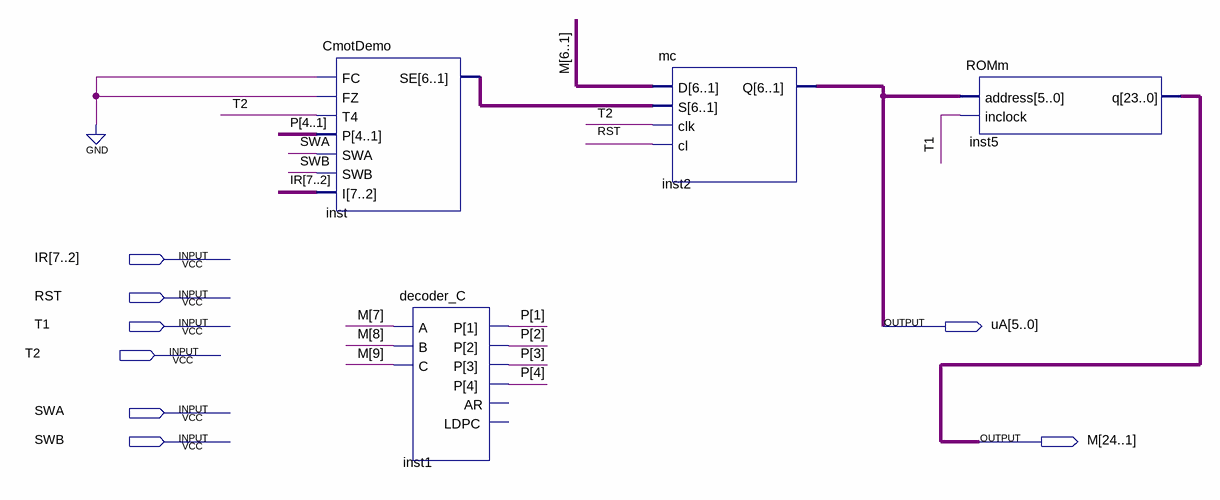
[diagram p0: schematic sheet]
// Quartus schematic UPC.bdf as structural Verilog: 4 symbols, 8 pins
module UPC (
  input  [7:2] IR,
  input  RST,
  input  T1,
  input  T2,
  input  SWA,
  input  SWB,
  output [5:0] uA,
  output [24:1] M
);

  wire [4:1] P;
  wire [5:0] inst_se;

  CmotDemo inst (.FC(1'b0), .FZ(1'b0), .T4(T2), .P(P), .SWA(SWA), .SWB(SWB), .I(IR), .SE(inst_se));
  decoder_C inst1 (.A(M[7]), .B(M[8]), .C(M[9]), .P(P));  // open: AR, LDPC
  mc inst2 (.D(M[6:1]), .S(inst_se), .clk(T2), .cl(RST), .Q(uA));
  ROMm inst5 (.address(uA), .inclock(T1), .q(M));
endmodule
